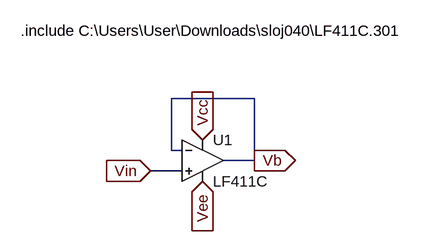
[diagram p0: schematic unity_buffer.asc]
unity_buffer.asc, the LTspice schematic file:
Version 4
SHEET 1 880 680
WIRE 256 80 128 80
WIRE 128 160 128 80
WIRE 144 160 128 160
WIRE 256 176 256 80
WIRE 256 176 208 176
WIRE 144 192 96 192
FLAG 176 144 Vcc
IOPIN 176 144 In
FLAG 176 208 Vee
IOPIN 176 208 In
FLAG 96 192 Vin
IOPIN 96 192 In
FLAG 256 176 Vb
IOPIN 256 176 Out
SYMBOL OpAmps\\opamp2 176 112 R0
SYMATTR InstName U1
SYMATTR Value LF411C
TEXT -104 -24 Left 2 !.include C:\\Users\\User\\Downloads\\sloj040\\LF411C.301

The netlist it stands for:
* unity_buffer.asc
XU1 Vin Vb Vcc Vee Vb LF411C  ; pins In+ In- V+ V- OUT
.include C:\Users\User\Downloads\sloj040\LF411C.301
.backanno
.end